# Altium schematic sheet Sheet1.SchDoc
size 381 x 241 mm; SheetNumber: 2; SheetTotal: 11
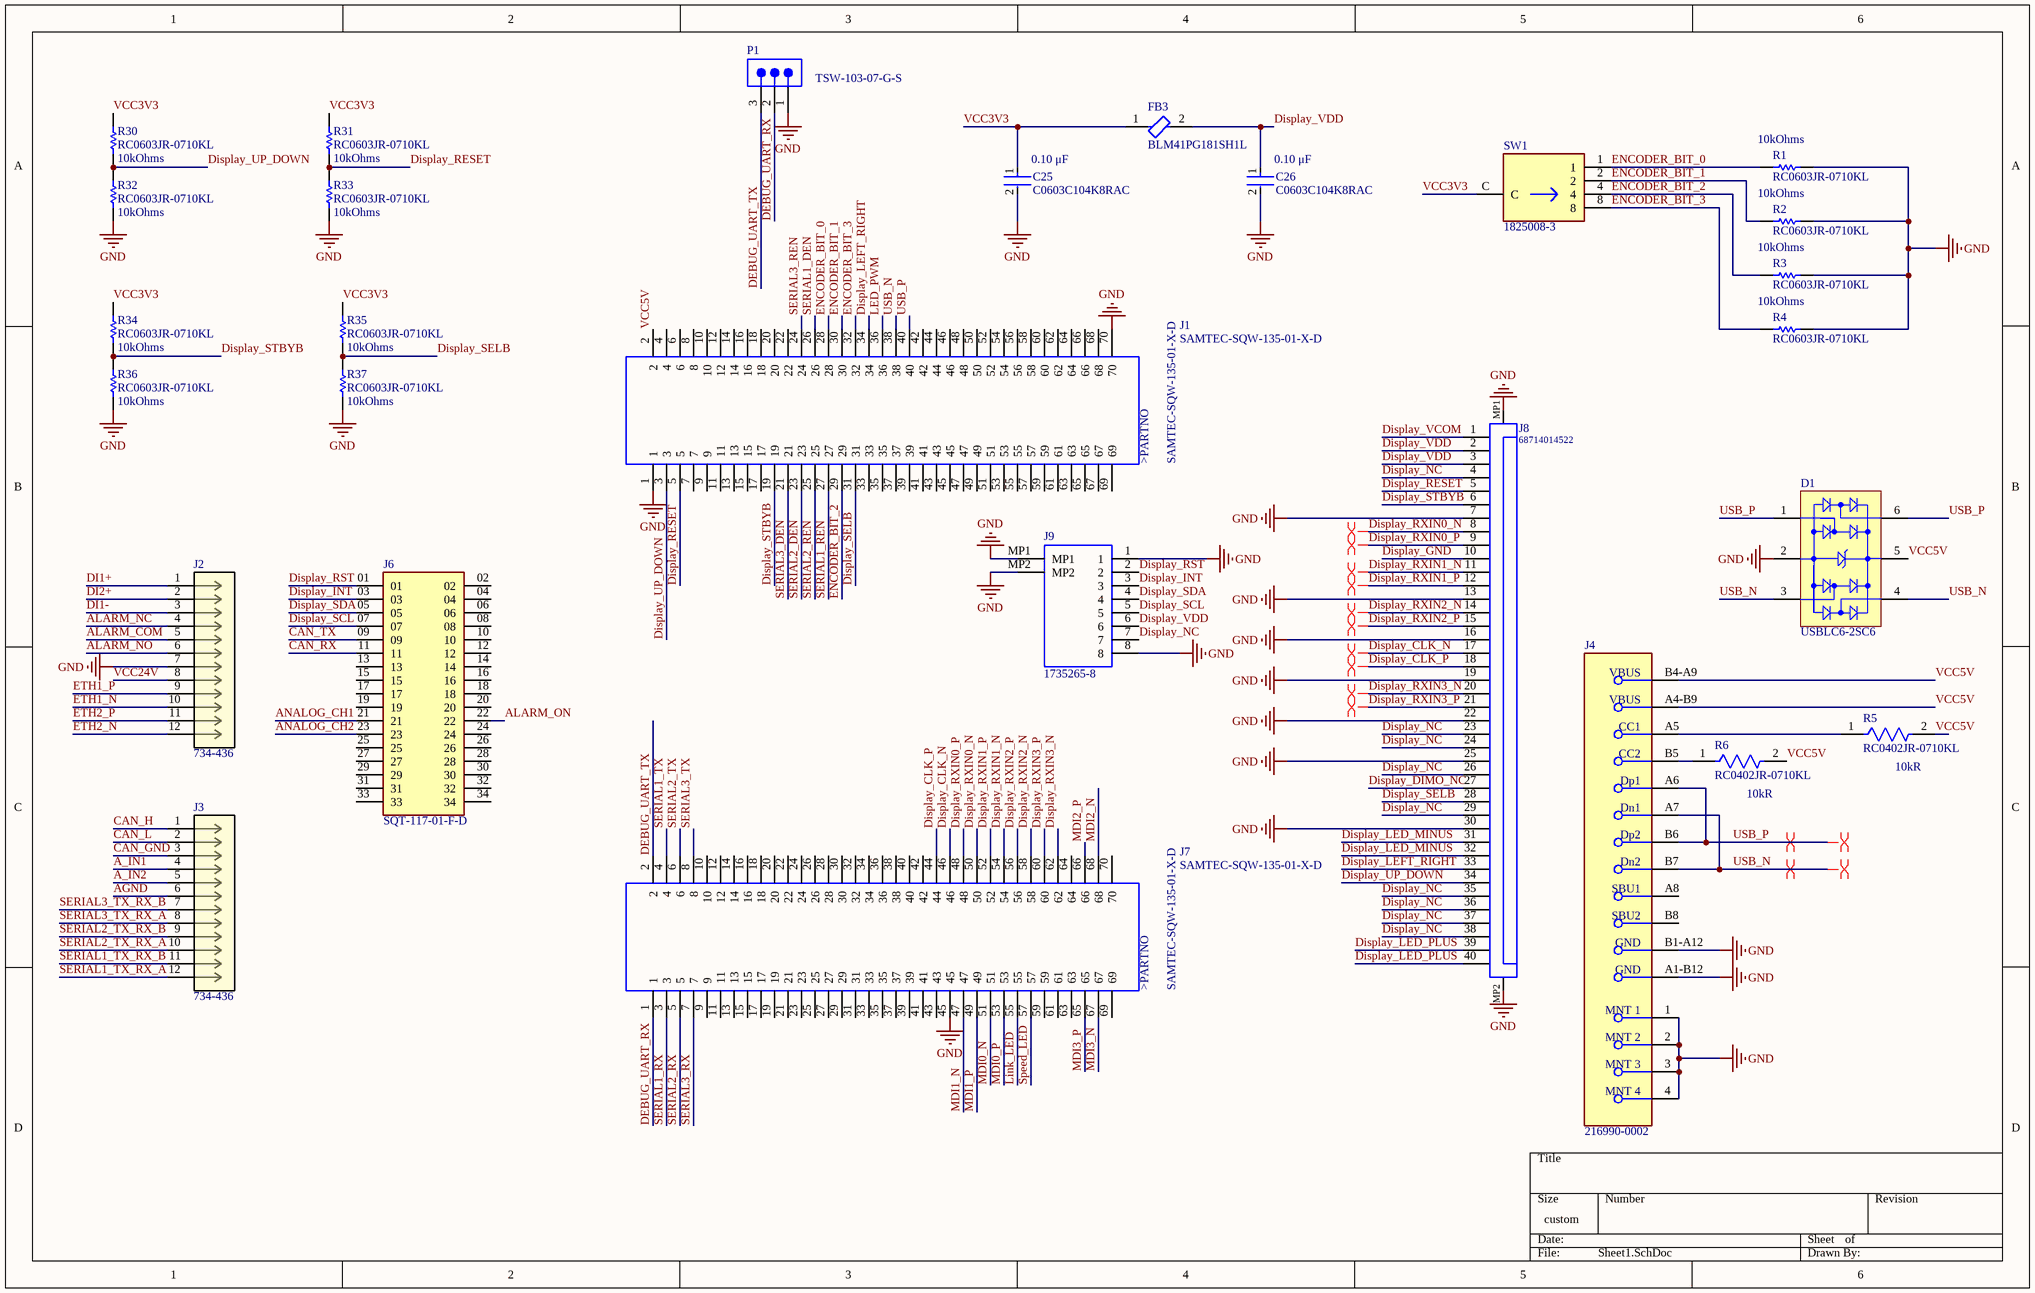
[diagram p0: Sheet1.SchDoc]

## Parts
C25  C0603C104K8RAC  Capacitance: 0.10 μF  [FP-C0603C-CF-MFG]
C26  C0603C104K8RAC  Capacitance: 0.10 μF  [FP-C0603C-CF-MFG]
D1  USBLC6-2SC6  [STM-SOT23-6L_V]
FB3  BLM41PG181SH1L  [FP-BLM41-0_2-a1_2-MFG]
J1  SAMTEC-SQW-135-01-X-D  [SAMTEC-SQW-135-01-X-D]
J2  734-436  [CONN12_734-436_WAG]
J3  734-436  [CONN12_734-436_WAG]
J4  216990-0002  [FP-216990-0002-MFG]
J6  SQT-117-01-F-D  [SAMTEC_SQT-117-01-F-D]
J7  SAMTEC-SQW-135-01-X-D  [SAMTEC-SQW-135-01-X-D]
J8  68714014522  [68714014522]
J9  1735265-8  [17352658]
P1  TSW-103-07-G-S  [SMTC-TSW-103-07-X-S]
R1  RC0603JR-0710KL  Resistance: 10kOhms  [RESC1608X55X25ML10T15]
R2  RC0603JR-0710KL  Resistance: 10kOhms  [RESC1608X55X25ML10T15]
R3  RC0603JR-0710KL  Resistance: 10kOhms  [RESC1608X55X25ML10T15]
R4  RC0603JR-0710KL  Resistance: 10kOhms  [RESC1608X55X25ML10T15]
R5  RC0402JR-0710KL  Resistance: 10kR  [FP-RC0402-0_4-IPC_C]
R6  RC0402JR-0710KL  Resistance: 10kR  [FP-RC0402-0_4-IPC_C]
R30  RC0603JR-0710KL  Resistance: 10kOhms  [RESC1608X55X25ML10T15]
R31  RC0603JR-0710KL  Resistance: 10kOhms  [RESC1608X55X25ML10T15]
R32  RC0603JR-0710KL  Resistance: 10kOhms  [RESC1608X55X25ML10T15]
R33  RC0603JR-0710KL  Resistance: 10kOhms  [RESC1608X55X25ML10T15]
R34  RC0603JR-0710KL  Resistance: 10kOhms  [RESC1608X55X25ML10T15]
R35  RC0603JR-0710KL  Resistance: 10kOhms  [RESC1608X55X25ML10T15]
R36  RC0603JR-0710KL  Resistance: 10kOhms  [RESC1608X55X25ML10T15]
R37  RC0603JR-0710KL  Resistance: 10kOhms  [RESC1608X55X25ML10T15]
SW1  1825008-3  [FP-1825008-3-MFG]

## Nets
GND: C25.2 C26.2 D1.2(GND) J1.1 J1.70 J2.7 J4.1(MNT_1) J4.2(MNT_2) J4.3(MNT_3) J4.4(MNT_4) J4.A1-B12(GND) J4.B1-A12(GND) J7.45 J8.7 J8.13 J8.16 J8.19 J8.22 J8.25 J8.30 J8.MP1 J8.MP2 J9.1 J9.8 J9.MP1 J9.MP2 P1.1 R1.2 R2.2 R3.2 R4.2 R32.1 R33.1 R36.1 R37.1
A_IN1: J3.4
A_IN2: J3.5
AGND: J3.6
ALARM_COM: J2.5
ALARM_NC: J2.4
ALARM_NO: J2.6
ALARM_ON: J6.22
ANALOG_CH1: J6.21
ANALOG_CH2: J6.23
CAN_GND: J3.3
CAN_H: J3.1
CAN_L: J3.2
CAN_RX: J6.11
CAN_TX: J6.09
DEBUG_UART_RX: J7.1 P1.2
DEBUG_UART_TX: J7.2 P1.3
DI1+: J2.1
DI1-: J2.3
DI2+: J2.2
Display_CLK_N: J7.46 J8.17
Display_CLK_P: J7.44 J8.18
Display_DIMO_NC: J8.27
Display_GND: J8.10
Display_INT: J6.03 J9.3
Display_LED_MINUS: J8.31 J8.32
Display_LED_PLUS: J8.39 J8.40
Display_LEFT_RIGHT: J1.34 J8.33
Display_NC: J8.4 J8.23 J8.24 J8.26 J8.29 J8.35 J8.36 J8.37 J8.38 J9.7
Display_RESET: J1.5 J8.5 R31.1 R33.2
Display_RST: J6.01 J9.2
Display_RXIN0_N: J7.50 J8.8
Display_RXIN0_P: J7.48 J8.9
Display_RXIN1_N: J7.54 J8.11
Display_RXIN1_P: J7.52 J8.12
Display_RXIN2_N: J7.58 J8.14
Display_RXIN2_P: J7.56 J8.15
Display_RXIN3_N: J7.62 J8.20
Display_RXIN3_P: J7.60 J8.21
Display_SCL: J6.07 J9.5
Display_SDA: J6.05 J9.4
Display_SELB: J1.31 J8.28 R35.1 R37.2
Display_STBYB: J1.19 J8.6 R34.1 R36.2
Display_UP_DOWN: J1.3 J8.34 R30.1 R32.2
Display_VCOM: J8.1
Display_VDD: C26.1 FB3.2 J8.2 J8.3 J9.6
ENCODER_BIT_0: J1.28 R1.1 SW1.1
ENCODER_BIT_1: J1.30 R2.1 SW1.2
ENCODER_BIT_2: J1.29 R3.1 SW1.4
ENCODER_BIT_3: J1.32 R4.1 SW1.8
ETH1_N: J2.10
ETH1_P: J2.9
ETH2_N: J2.12
ETH2_P: J2.11
LED_PWM: J1.36
Link_LED: J7.55
MDI0_N: J7.51
MDI0_P: J7.53
MDI1_N: J7.47
MDI1_P: J7.49
MDI2_N: J7.68
MDI2_P: J7.66
MDI3_N: J7.67
MDI3_P: J7.65
SERIAL1_DEN: J1.26
SERIAL1_REN: J1.27
SERIAL1_RX: J7.3
SERIAL1_TX: J7.4
SERIAL1_TX_RX_A: J3.12
SERIAL1_TX_RX_B: J3.11
SERIAL2_DEN: J1.23
SERIAL2_REN: J1.25
SERIAL2_RX: J7.5
SERIAL2_TX: J7.6
SERIAL2_TX_RX_A: J3.10
SERIAL2_TX_RX_B: J3.9
SERIAL3_DEN: J1.21
SERIAL3_REN: J1.24
SERIAL3_RX: J7.7
SERIAL3_TX: J7.8
SERIAL3_TX_RX_A: J3.8
SERIAL3_TX_RX_B: J3.7
Speed_LED: J7.57
USB_N: D1.3(I/O_2) D1.4(I/O_3) J1.38 J4.A7(Dn1) J4.B7(Dn2)
USB_P: D1.1(I/O_1) D1.6(I/O_4) J1.40 J4.A6(Dp1) J4.B6(Dp2)
VCC3V3: C25.1 FB3.1 R30.2 R31.2 R34.2 R35.2 SW1.C
VCC5V: D1.5(VBUS) J1.2 J4.A4-B9(VBUS) J4.B4-A9(VBUS) R5.2 R6.2
VCC24V: J2.8
NetJ4_A5: J4.A5(CC1) R5.1
NetJ4_B5: J4.B5(CC2) R6.1

Not connected (* = marked no-connect by the designer): J1 4 6 7 8 9 10 11 12 13 14 15 16 17 18 20 22 33 35 37 39 41 42 43 44 45 46 47 48 49 50 51 52 53 54 55 56 57 58 59 60 61 62 63 64 65 66 67 68 69; J4 A8(SBU1) B8(SBU2); J6 02 04 06 08 10 12 13 14 15 16 17 18 19 20 24 25 26 27 28 29 30 31 32 33 34; J7 9 10 11 12 13 14 15 16 17 18 19 20 21 22 23 24 25 26 27 28 29 30 31 32 33 34 35 36 37 38 39 40 41 42 43 59 61 63 64 69 70

## Layout directives
differential pair: Display_CLK_N, Display_CLK_P, Display_RXIN0_N, Display_RXIN0_P, Display_RXIN1_N, Display_RXIN1_P, Display_RXIN2_N, Display_RXIN2_P, Display_RXIN3_N, Display_RXIN3_P, USB_N, USB_P
net class diff90: USB_N, USB_P
net class diff120: Display_CLK_N, Display_CLK_P, Display_RXIN0_N, Display_RXIN0_P, Display_RXIN1_N, Display_RXIN1_P, Display_RXIN2_N, Display_RXIN2_P, Display_RXIN3_N, Display_RXIN3_P

## Notes on the sheet
- (in symbol SAMTEC-SQW-135-01-X-D) >PARTNO

## Library data of the parts
C25 C26 = CMP-03020-006081-2: C0603 0.10 μF X7R 30ppm/°C 10.00% 10 V; Manufacturer: KEMET; Value: 0.10 μF; Material: Ceramic; Automotive Grade: Grade 1; Voltage Rating: 10 V; Tolerance: 0.1; Automotive: Yes; Device Class L2: Capacitors; Height: 0.87mm; Temperature Range High: +125°C; Temperature Coefficient: 30ppm/°C; Temperature Range Low: -55°C; Package: C0603C-CF; Lead Free: Yes; Octopart: https://octopart.com/c0603c104k8rac-kemet-1325403; Manufacturer Part Number: C0603C104K8RAC; Temperature: -55°C to +125°C; Mouser Description: .1UF 10V 10% 0603; RoHS: TRUE; ComponentLink2URL: https://api.kemet.com/component-edge/download/datasheet/C0603C100J5GACAUTO.pdf; ComponentLink2Description: Datasheet; Temperature Characteristic: X7R; Device Class L1: Passive Components; Category: Cap; Device Class L3: Ceramic Capacitors
D1 = CMP-2000-05378-1: Very low capacitance ESD protection, 3.5 pF, -40 to 125 degC, 6-Pin SOT23, RoHS, Tape and Reel; Manufacturer: STMicroelectronics; Polarity: Uni-Directional; Clamping Voltage: 17V; Rad Hardened: No; Product Height (mm): 1.3mm; Leakage Current (Max): 0.15uA; Product Length (mm): 3.05mm; Number of Elements: 1; Peak Pulse Current: 5A; Configuration: Dual; Reverse Breakdown Voltage: 6V; Working Voltage (Max): 5V; Capacitance Value: 3.5pF; Suppressor Type: DiodeArrays; Product Depth (mm): 1.75mm; Test Current (It): 1mA; Package / Case: SOT-23; Operating Temperature Max Deg. C: 125C; Package Description: 6-Pin Small Outline Transistor, Body 2.925 x 1.625 mm, Pitch 0.95 mm; Package Reference: SOT23-6L; Datasheet Version: Rev. 5, 10/2011; Operating Temperature Min Deg. C: -40C; Mounting Style: SurfaceMount; Direction Type: Uni-Directional; Mounting: SurfaceMount; Pin Count: 6; Leakage Current: 0.15uA; Packaging: TapeandReel; Operating Temperature Classification: Automotive; Clamping Voltage (Max): 17V; Manufacturer URL: http://www.st.com/; Reverse Stand-off Voltage: 5V; Datasheet URL: http://www.st.com/st-web-ui/static/active/en/resource/technical/document/datasheet/CD00050750.pdf; Working Voltage: 5V; Operating Temp Range: -40Cto125C
FB3 = CMP-06046-002023-1: Ferrite Bead, 1806, 180Ω @ 100MHz, 25%, 0.02Ω, 3.5A; Impedance: 180R; Number of Lines: 1; Max DC Current: 50mA; DC Resistance (DCR): 20mR; Mount: Surface Mount; Length: 4.5mm; Tolerance: 25%; Series: EMIFIL®, BLM41P; Package Quantity: 2500; Min Operating Temperature: -55°C; Max Operating Temperature: 125°C; Height: 0.071inch; Packaging: Tape and Reel; Contact Plating: Tin; Test Frequency: 100MHz; Ratings: AEC-Q200; Case Code (Metric): 4516; Termination: SMD/SMT; Case Code (Imperial): 1806; Width: 0.063inch; Max Current Rating: 3.5A; Case/Package: 1806
J2 J3 = 734-436: No Description Available; Mfr_Name: Wago; Copyright: Copyright (C) 2022 Ultra Librarian. All rights reserved.; Manufacturer_Part_Number: 734-436; RefDes: RefDes; Type: DEV
J4 = CMP-04767-000018-1: CONN RCP USB2.0 TYP C 24P SMD RA
J6 = SQT-117-01-F-D: MF: Samtec; Package: None; Value: *; Price: None; MP: SQT-117-01-F-D; Availability: Unavailable
J8 = CMP-1502-01545-1: SMT ZIF Connectors WR-FPC, Horizontal, Bottom Contact, pitch 0.5 mm, 40 pins; Manufacturer: Wurth Elektronik; Pitch: 0.5mm; Contact Resistance: 20mOhm; Working Voltage: 50VAC; Rated Current: 0.5A; Withstanding Voltage: 250VAC; Pin Number: 40; Part Number: 68714014522; Package Reference: 68714014522; Manufacturer URL: http://www.we-online.de; Operating Temperature: -25to85degC; Publisher: WurthElektronik; Datasheet URL: https://katalog.we-online.de/em/datasheet/68714014522.pdf; Packaging: TapeandReel; Contact Design: BottomContact; Orientation: Horizontal; Mounting Technology: SMT
J9 = 1735265-8: 1MM FPC HORZ.BOTTOM CONT.ASSY 8P (Au); Manufacturer_Name: TE Connectivity; Geometry.Height: 2.74mm; Mouser Part Number: 571-1735265-8; Mouser Price/Stock: https://www.mouser.co.uk/ProductDetail/TE-Connectivity-AMP/1735265-8?qs=vkMqrgFpRajjm%252BbPDw7SSA%3D%3D; Manufacturer_Part_Number: 1735265-8; Datasheet Link: https://www.te.com/commerce/DocumentDelivery/DDEController?Action=showdoc&DocId=Customer+Drawing%7F1735265%7FB%7Ftif%7FEnglish%7FENG_CD_1735265_B.tif%7F1735265-8
P1 = CMP-1024-00333-1: 0.025" SQ Post Header, Through-hole, Vertical, -55 to 125 degC, 2.54 mm Pitch, 3-Pin, Male, RoHS; Manufacturer: Samtec; Pitch: 2.54 mm; ComponentLink3URL: http://www.samtec.com/documents/webfiles/cpdf/TSW-XXX-XX-XXX-X-XX-XXX-MKT.pdf; Temperature Range: -55 to 125 degC; DatasheetVersion: F-214; ComponentLink1Description: Manufacturer URL; ComponentLink2URL: http://www.samtec.com/documents/webfiles/pdf/TSW_TH.PDF; RoHS: True; Orientation: Vertical; ComponentLink2Description: Datasheet; ComponentLink3Description: Package Specification; PackageDescription: .025[0.64] SQ. Post Terminal Strip Assembly; Mounting Technology: Through-hole; PackageVersion: DM, 8/1988; ComponentLink1URL: http://www.samtec.com; PackageReference: TSW-103-07-X-S; PartNumber: TSW-103-07-G-S
R1-R4 R30-R37 = CMP-2000-05022-1: Resistor, 10 KOhm, +/- 5%, 100 mW, -55 to 155 degC, 0603 (1608 Metric), RoHS, Tape and Reel; Manufacturer: Yageo; Voltage Rating: 50V; Temperature Coefficient: 100PPM/C; Power Rating: 100mW; Package Reference: 603; Series: RC; Case Code - mm: 1608; Packaging: Reel; Datasheet URL: http://www.farnell.com/datasheets/443971.pdf; Datasheet Version: Rev. 4, 04/2009; Operating Temperature Range: -55Cto+155C; Product: ThickFilmResistorsGeneralPurpose; Package Description: 2-Pin Surface Mount Device, Body 1.6 x 0.8 mm; Manufacturer URL: http://www.yageo.com/; Case Code - in: 0603; Tolerance: 5%; Termination Style: SMD/SMT
R5 R6 = CMP-2002-07915-3: RES 10K OHM 5% 1/16W 0402; Max Power Dissipation: 63mW; Temperature Coefficient: 100ppm/°C; Power Rating: 62.5mW; Voltage Rating: 50V; Size Code: 0402; Resistance Tolerance: 5%; Packaging: Tape and Reel; Case Code (Metric): 1005; Lead Free: Lead Free; Resistor Type: Thick Film; Min Operating Temperature: -55°C; Military Standard: Not; Depth: 0.5mm; Series: RC; Case/Package: 0402; Construction: Rectangular; Number of Terminations: 2; Package Quantity: 1; Termination: SMD/SMT; Length: 0.039inch; Case Code (Imperial): 0402; Height: 0.016inch; Features: Moisture Resistant; RoHS Compliant: Yes; Max Operating Temperature: 155°C; Tolerance: 5%; Width: 0.02inch
SW1 = CMP-03404-000004-1: SW ROTARY DIP HEX COMP 0.4VA 20V; Sealable: No (Without); Washable: Yes; Number of Positions: 16; Illumination Type: Illuminated; Pitch: 2.54mm; Throw Configuration: SP16T; Series: DRD, Alcoswitch; Voltage Rating (AC): 20V; Housing Material: Thermoplastic; Max Operating Temperature: 85°C; Contact Plating: Gold; ELV: Compliant; Package Quantity: 45; Flammability Rating: UL94 V-0; Radiation Hardening: No; Voltage Rating (DC): 20V; Contact Material: Copper Alloy; Packaging: Rail/Tube; Depth: 12mm; Min Operating Temperature: -30°C; Max Voltage Rating (AC): 20V; Housing Color: Black; Length: 10mm; Mount: Through Hole; Lead Free: Lead Free; Actuator Type: Rotary; RoHS Compliant: Yes; Type: Switch; Max Voltage Rating (DC): 20V; Orientation: Right Angle; Termination: PC Pins
J1 J7 = SAMTEC-SQW-135-01-X-D: Package: None; Price: None; Value: *; MP: SAMTEC-SQW-135-01-X-D; Availability: Unavailable